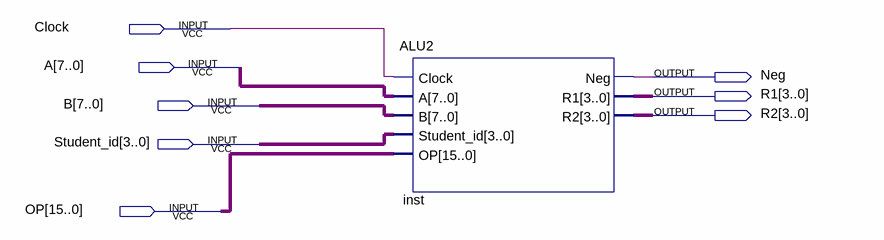
[diagram p0: schematic sheet]
// Quartus schematic ALU2basic.bdf as structural Verilog: 1 symbols, 8 pins
module ALU2basic (
  input  Clock,
  input  [7:0] A,
  input  [7:0] B,
  input  [3:0] Student_id,
  input  [15:0] OP,
  output Neg,
  output [3:0] R1,
  output [3:0] R2
);

  ALU2 inst (.Clock(Clock), .A(A), .B(B), .Student_id(Student_id), .OP(OP), .Neg(Neg), .R1(R1), .R2(R2));
endmodule
